# EAGLE schematic Tiny2313-1 (EAGLE 5.00)
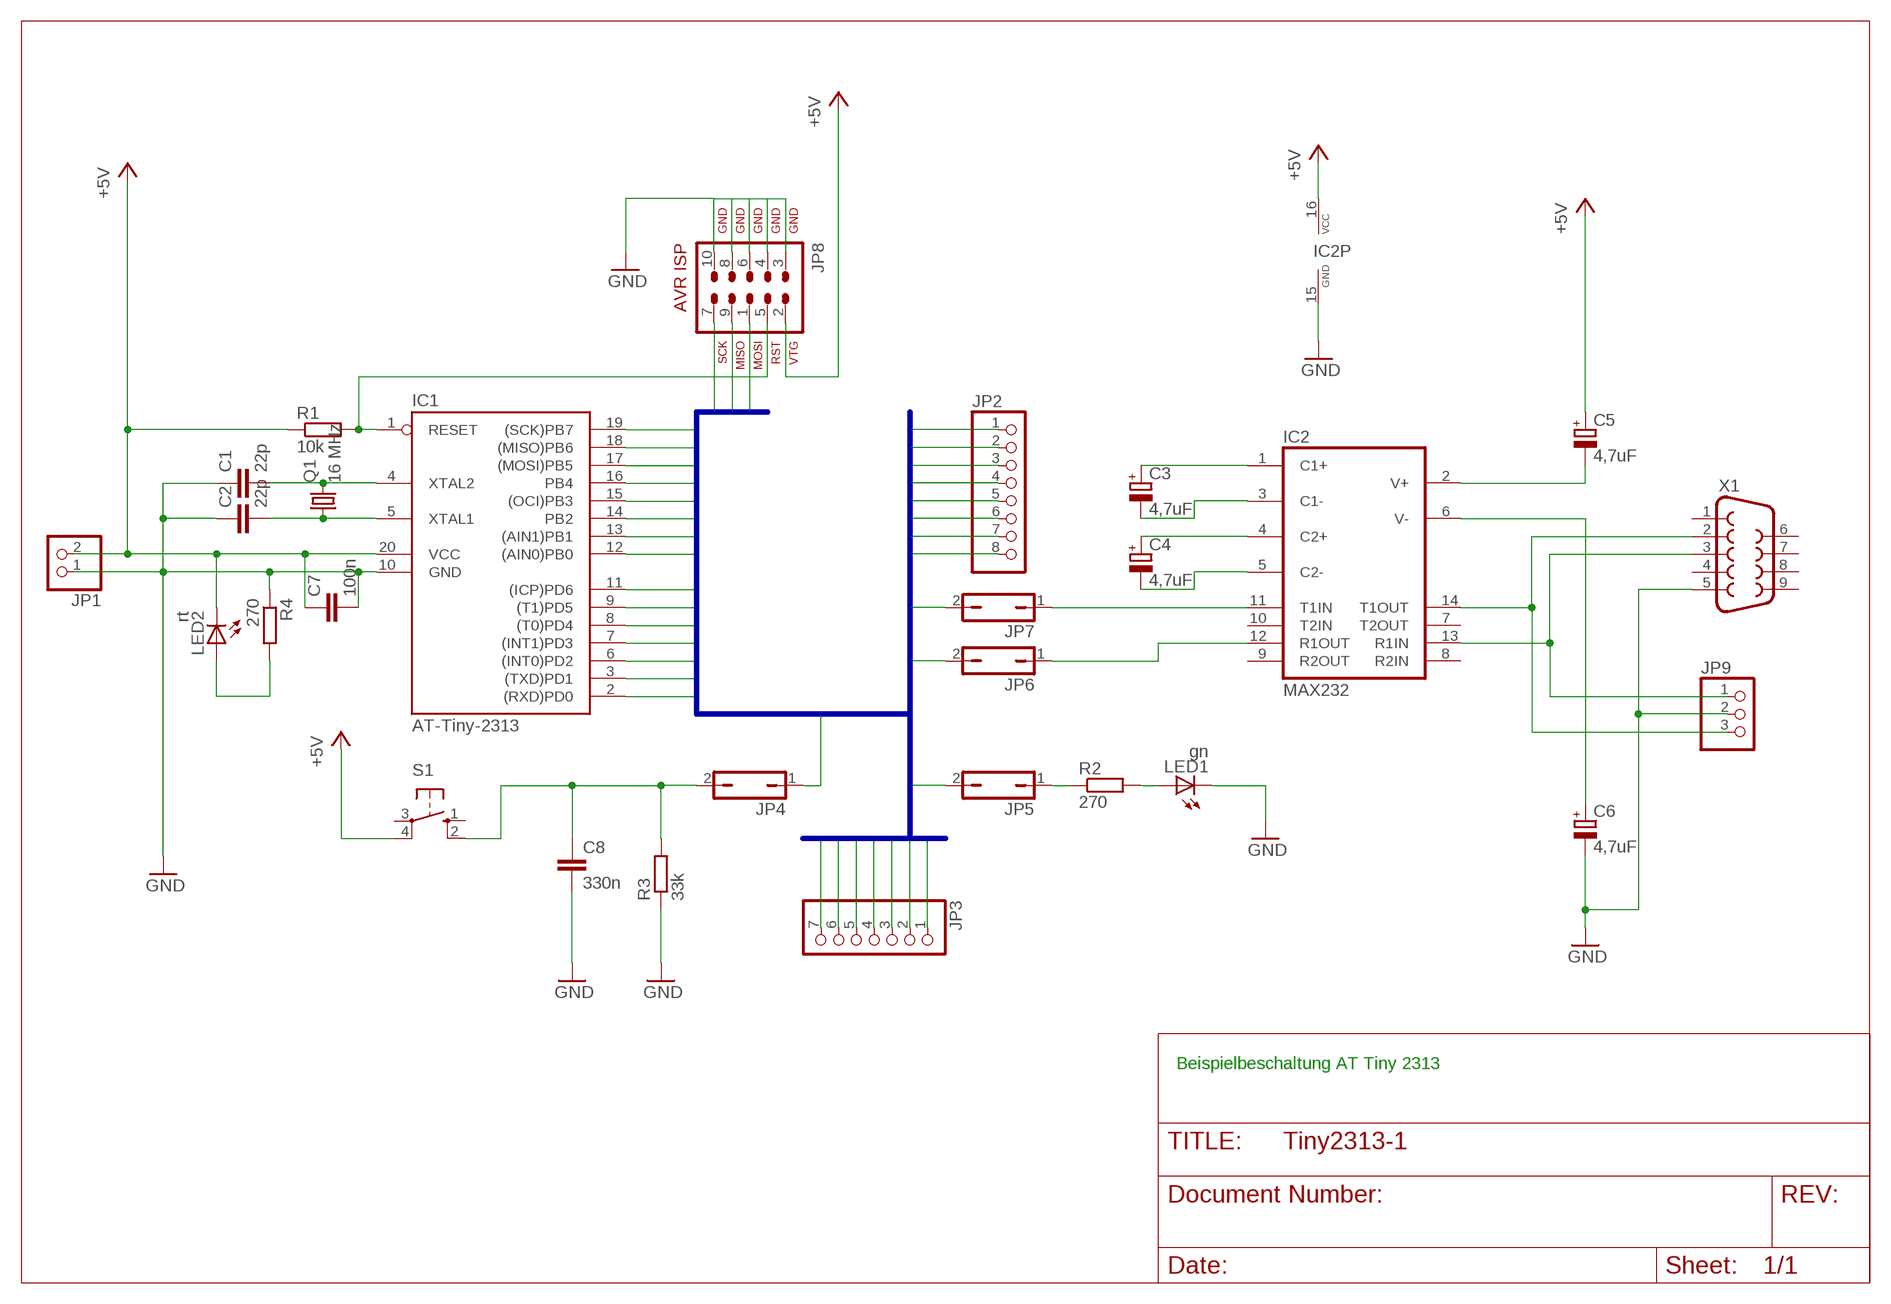
[diagram p0: schematic, sheet 1]

## Parts
C1  22p  C-EU050-024X044  [C050-024X044]
C2  22p  C-EU050-024X044  [C050-024X044]
C3  4,7uF  CPOL-EUE2-5  [E2-5]
C4  4,7uF  CPOL-EUE2-5  [E2-5]
C5  4,7uF  CPOL-EUE2-5  [E2-5]
C6  4,7uF  CPOL-EUE2-5  [E2-5]
C7  100n  C-EU075-032X103  [C075-032X103]
C8  330n  C-EU075-032X103  [C075-032X103]
IC1  AT-Tiny-2313  AT90S2313P  [DIL20]
IC2  MAX232  [DIL16]
JP1  PINHD-1X2  [1X02]
JP2  PINHD-1X8  [1X08]
JP3  PINHD-1X7  [1X07]
JP4  JP1Q  [JP1]
JP5  JP1Q  [JP1]
JP6  JP1Q  [JP1]
JP7  JP1Q  [JP1]
JP8  AVR-ISP-10  [AVR-ISP-10]
JP9  PINHD-1X3  [1X03]
LED1  gn  LED3MM  [LED3MM]
LED2  rt  LED3MM  [LED3MM]
Q1  16 MHz  CRYSTALHC49S  [HC49/S]
R1  10k  R-EU_0204/7  [0204/7]
R2  270  R-EU_0204/7  [0204/7]
R3  33k  R-EU_0204/7  [0204/7]
R4  270  R-EU_0204/7  [0204/7]
S1  10-XX  [B3F-10XX]
X1  F09HP  [F09HP]

## Nets
+5V: C5.+ C7.1 IC1.20(VCC) IC2.16(VCC) JP1.2 JP8.2 LED2.K(C) R1.1 S1.4(P1)
GND: C1.1 C2.1 C6.- C7.2 C8.2 IC1.10(GND) IC2.15(GND) JP1.1 JP8.3 JP8.4 JP8.6 JP8.8 JP8.10 JP9.2 LED1.K(C) R3.1 R4.1 X1.5
N$1: C1.2 IC1.4(XTAL2) Q1.2
N$2: C2.2 IC1.5(XTAL1) Q1.1
N$3: IC1.1(RESET) JP8.5 R1.2
N$8: C3.+ IC2.1(C1+)
N$9: C3.- IC2.3(C1-)
N$10: C4.+ IC2.4(C2+)
N$11: C4.- IC2.5(C2-)
N$12: C5.- IC2.2(V+)
N$13: C6.+ IC2.6(V-)
N$18: LED1.A R2.2
N$19: C8.1 JP4.2 R3.2 S1.2(S1)
N$28: JP5.1 R2.1
N$30: LED2.A R4.2
PB0: IC1.12((AIN0)PB0) JP2.1
PB1: IC1.13((AIN1)PB1) JP2.2
PB2: IC1.14(PB2) JP2.3
PB3: IC1.15((OCI)PB3) JP2.4
PB4: IC1.16(PB4) JP2.5
PB5: IC1.17((MOSI)PB5) JP2.6 JP8.1
PB6: IC1.18((MISO)PB6) JP2.7 JP8.9
PB7: IC1.19((SCK)PB7) JP2.8 JP8.7
PD0: IC1.2((RXD)PD0) JP3.1 JP6.2
PD1: IC1.3((TXD)PD1) JP3.2 JP7.2
PD2: IC1.6((INT0)PD2) JP3.3
PD3: IC1.7((INT1)PD3) JP3.4 JP4.1
PD4: IC1.8((T0)PD4) JP3.5
PD5: IC1.9((T1)PD5) JP3.6 JP5.2
PD6: IC1.11((ICP)PD6) JP3.7
RXD: IC2.13(R1IN) JP9.1 X1.3
TTL-RXD: IC2.12(R1OUT) JP6.1
TTL-TXD: IC2.11(T1IN) JP7.1
TXD: IC2.14(T1OUT) JP9.3 X1.2
Unconnected: IC2.7(T2OUT) IC2.8(R2IN) IC2.9(R2OUT) IC2.10(T2IN) S1.1(S) S1.3(P) X1.1 X1.4 X1.6 X1.7 X1.8 X1.9

## Buses
PB[0..7],PD[0..6]

## Notes on the sheet
- Beispielbeschaltung AT Tiny 2313

## Library data of the parts
C1 C2 C7 C8 = rcl:C-EU: CAPACITOR, European symbol
C3-C6 = rcl:CPOL-EU: POLARIZED CAPACITOR, European symbol
IC1 = avr-4:AT90S2313: MICROCONTROLLER 2 Kbytes FLASH 128 bytes SRAM 128 bytes EEPROM UART
IC2 = maxim:MAX232: RS232 TRANSEIVER
JP1 = pinhead:PINHD-1X2: PIN HEADER
JP2 = pinhead:PINHD-1X8: PIN HEADER
JP3 = pinhead:PINHD-1X7: PIN HEADER
JP4-JP7 = jumper:JP1Q: JUMPER
JP8 = atmel:AVR-ISP-10: AVR ISP-10 Serial Programming Header
JP9 = pinhead:PINHD-1X3: PIN HEADER
LED1 LED2 = led:LED: LED OSRAM: - CHIPLED LG R971, LG N971, LY N971, LG Q971, LY Q971, LO R971, LY R971 LH N974, LH R974 LS Q976, LO Q976, LY Q976 LO Q996 - Hyper CHIPLED LW Q18S LB Q993, LB Q99A, LB R99A - SideLED LS A670, LO A670, LY A670, LG A670, LP A670 LB A673, LV A673, LT A673, LW A673 LH A674 LY A675 LS A676, LA A676, LO A676, LY A676, LW A676 LS A679, LY A679, LG A679 - Hyper Micro SIDELED® LS Y876, LA Y876, LO Y876, LY Y876 LT Y87S - SmartLED LW L88C, LW L88S LB L89C, LB L89S, LG L890 LS L89K, LO L89K, LY L89K LS L896, LA L896, LO L896, LY L896 - TOPLED LS T670, LO T670, LY T670, LG T670, LP T670 LSG T670, LSP T670, LSY T670, LOP T670, LYG T670 LG T671, LOG T671, LSG T671 LB T673, LV T673, LT T673, LW T673 LH T674 LS T676, LA T676, LO T676, LY T676, LB T676, LH T676, LSB T676, LW T676 LB T67C, LV T67C, LT T67C, LS T67K, LO T67K, LY T67K, LW E67C LS E67B, LA E67B, LO E67B, LY E67B, LB E67C, LV E67C, LT E67C LW T67C LS T679, LY T679, LG T679 LS T770, LO T770, LY T770, LG T770, LP T770 LB T773, LV T773, LT T773, LW T773 LH T774 LS E675, LA E675, LY E675, LS T675 LS T776, LA T776, LO T776, LY T776, LB T776 LHGB T686 LT T68C, LB T68C - Hyper Mini TOPLED® LB M676 - Mini TOPLED Santana® LG M470 LS M47K, LO M47K, LY M47K Source: http://www.osram.convergy.de - LUMILED® LXK2-PW12-R00, LXK2-PW12-S00, LXK2-PW14-U00, LXK2-PW14-V00 LXK2-PM12-R00, LXK2-PM12-S00, LXK2-PM14-U00 LXK2-PE12-Q00, LXK2-PE12-R00, LXK2-PE12-S00, LXK2-PE14-T00, LXK2-PE14-U00 LXK2-PB12-K00, LXK2-PB12-L00, LXK2-PB12-M00, LXK2-PB14-N00, LXK2-PB14-P00, LXK2-PB14-Q00 LXK2-PR12-L00, LXK2-PR12-M00, LXK2-PR14-Q00, LXK2-PR14-R00 LXK2-PD12-Q00, LXK2-PD12-R00, LXK2-PD12-S00 LXK2-PH12-R00, LXK2-PH12-S00 LXK2-PL12-P00, LXK2-PL12-Q00, LXK2-PL12-R00 Source: www.luxeon.com
Q1 = crystal:CRYSTAL: CRYSTAL
R1-R4 = rcl:R-EU_: RESISTOR, European symbol
S1 = switch-omron:10-XX: OMRON SWITCH
X1 = con-subd:F09: SUB-D